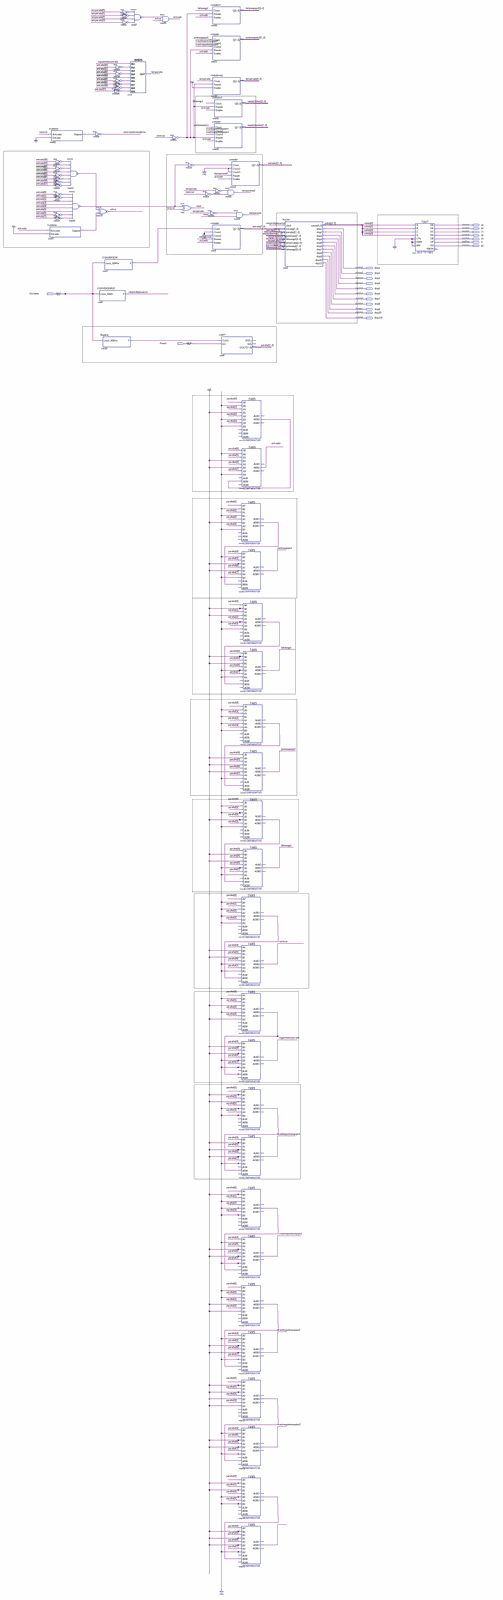
[diagram p0: schematic sheet, whole]
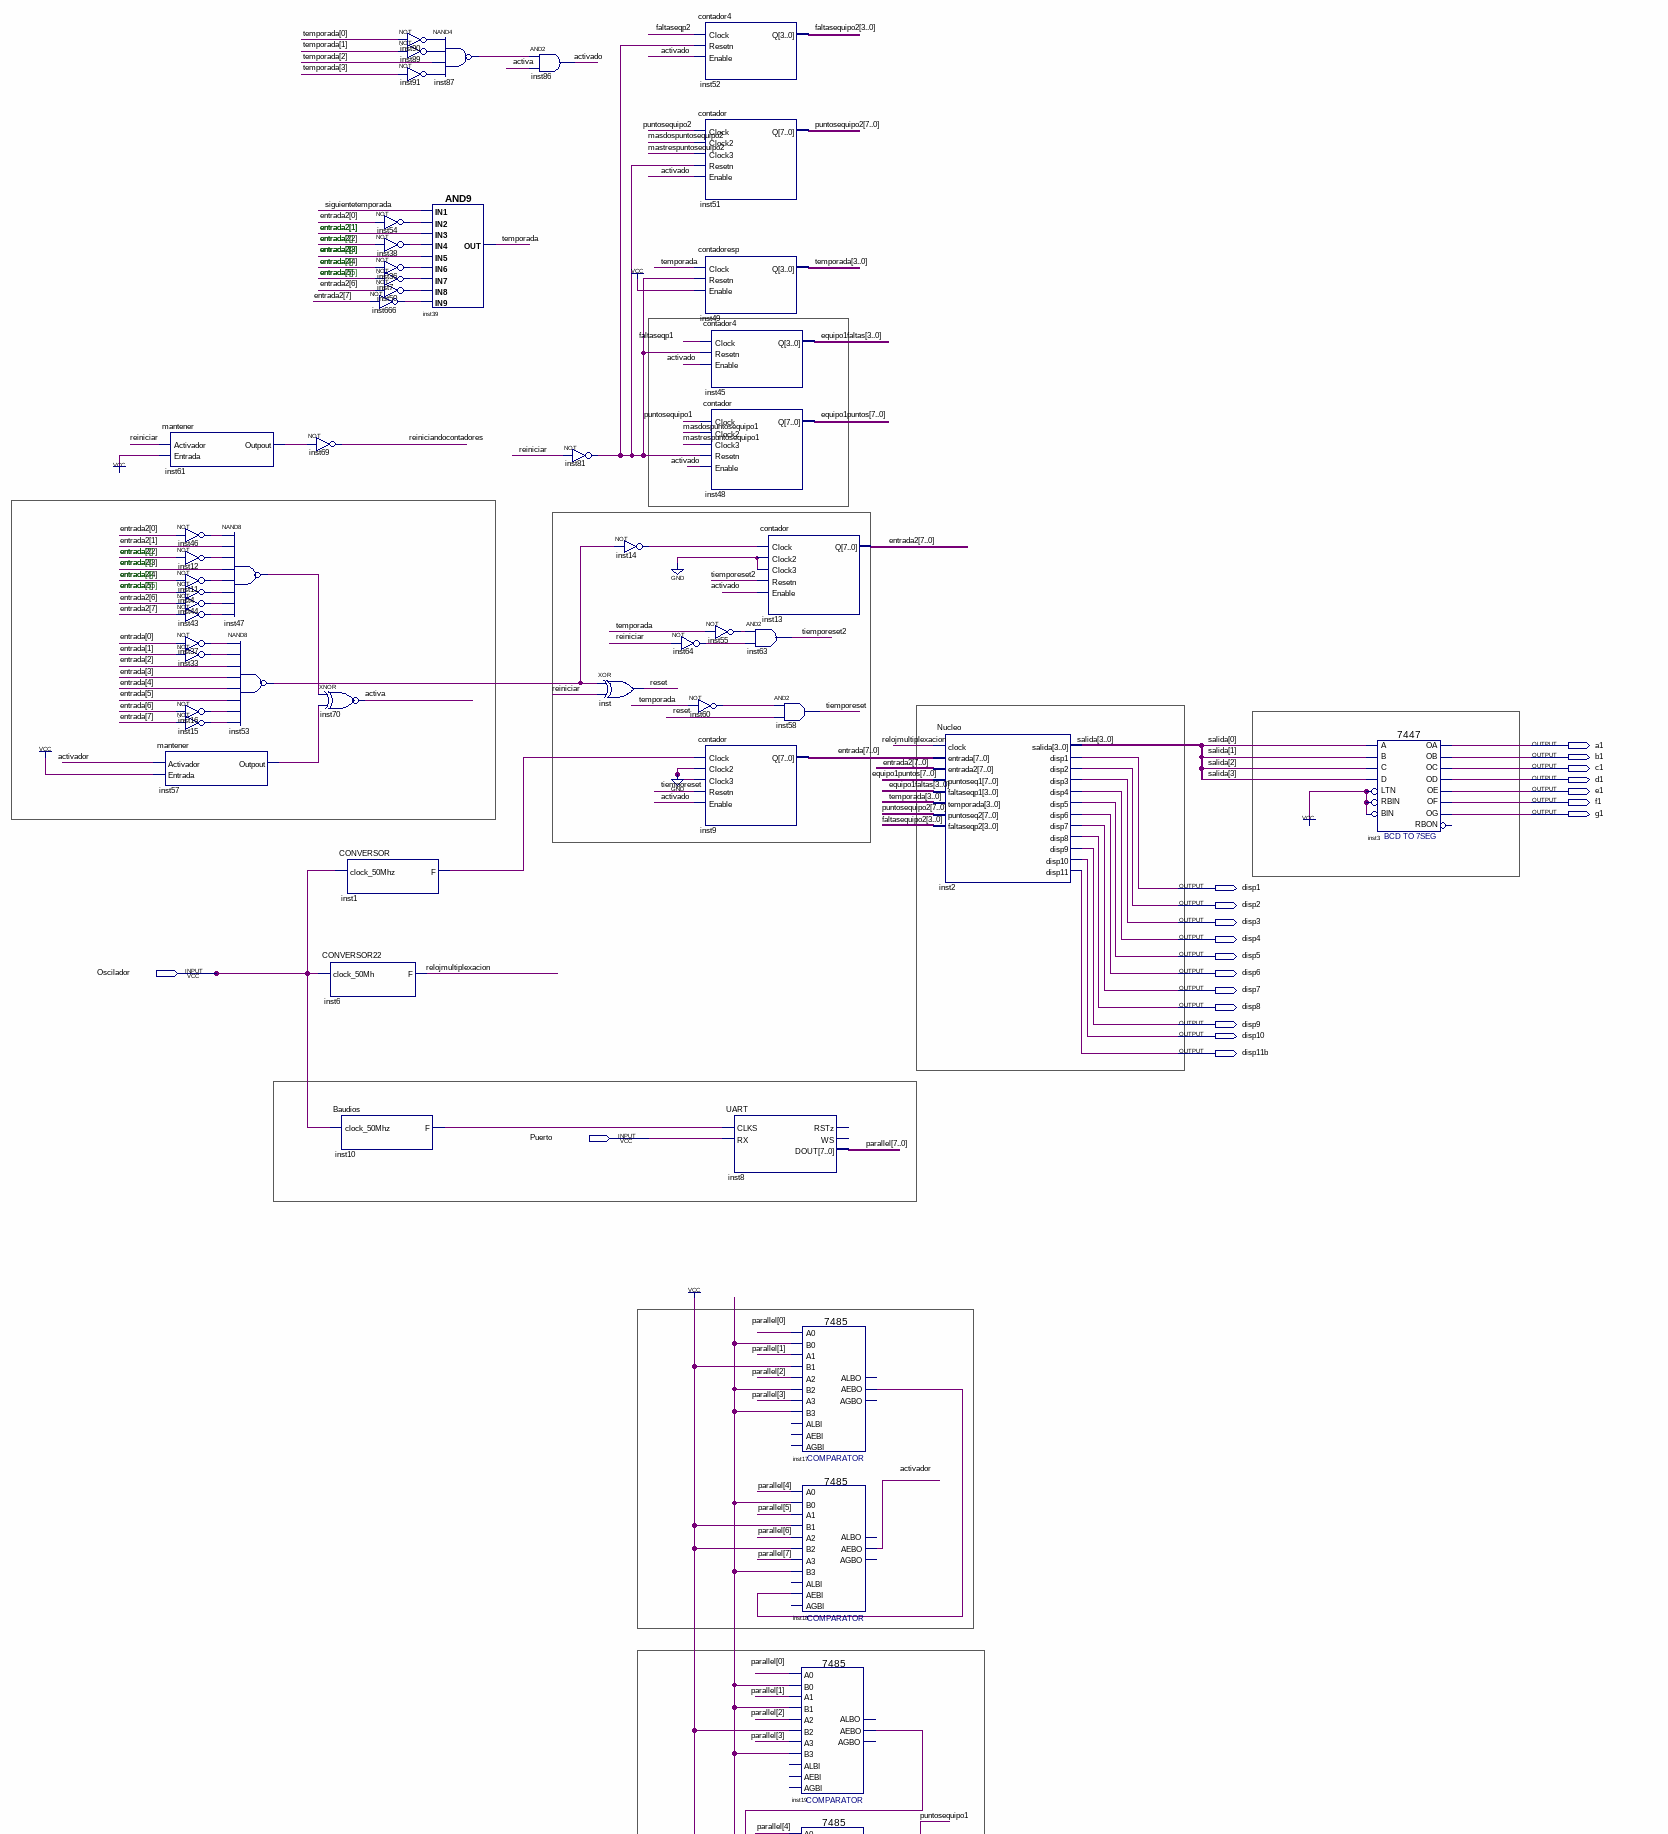
[diagram p1: schematic sheet, upper part]
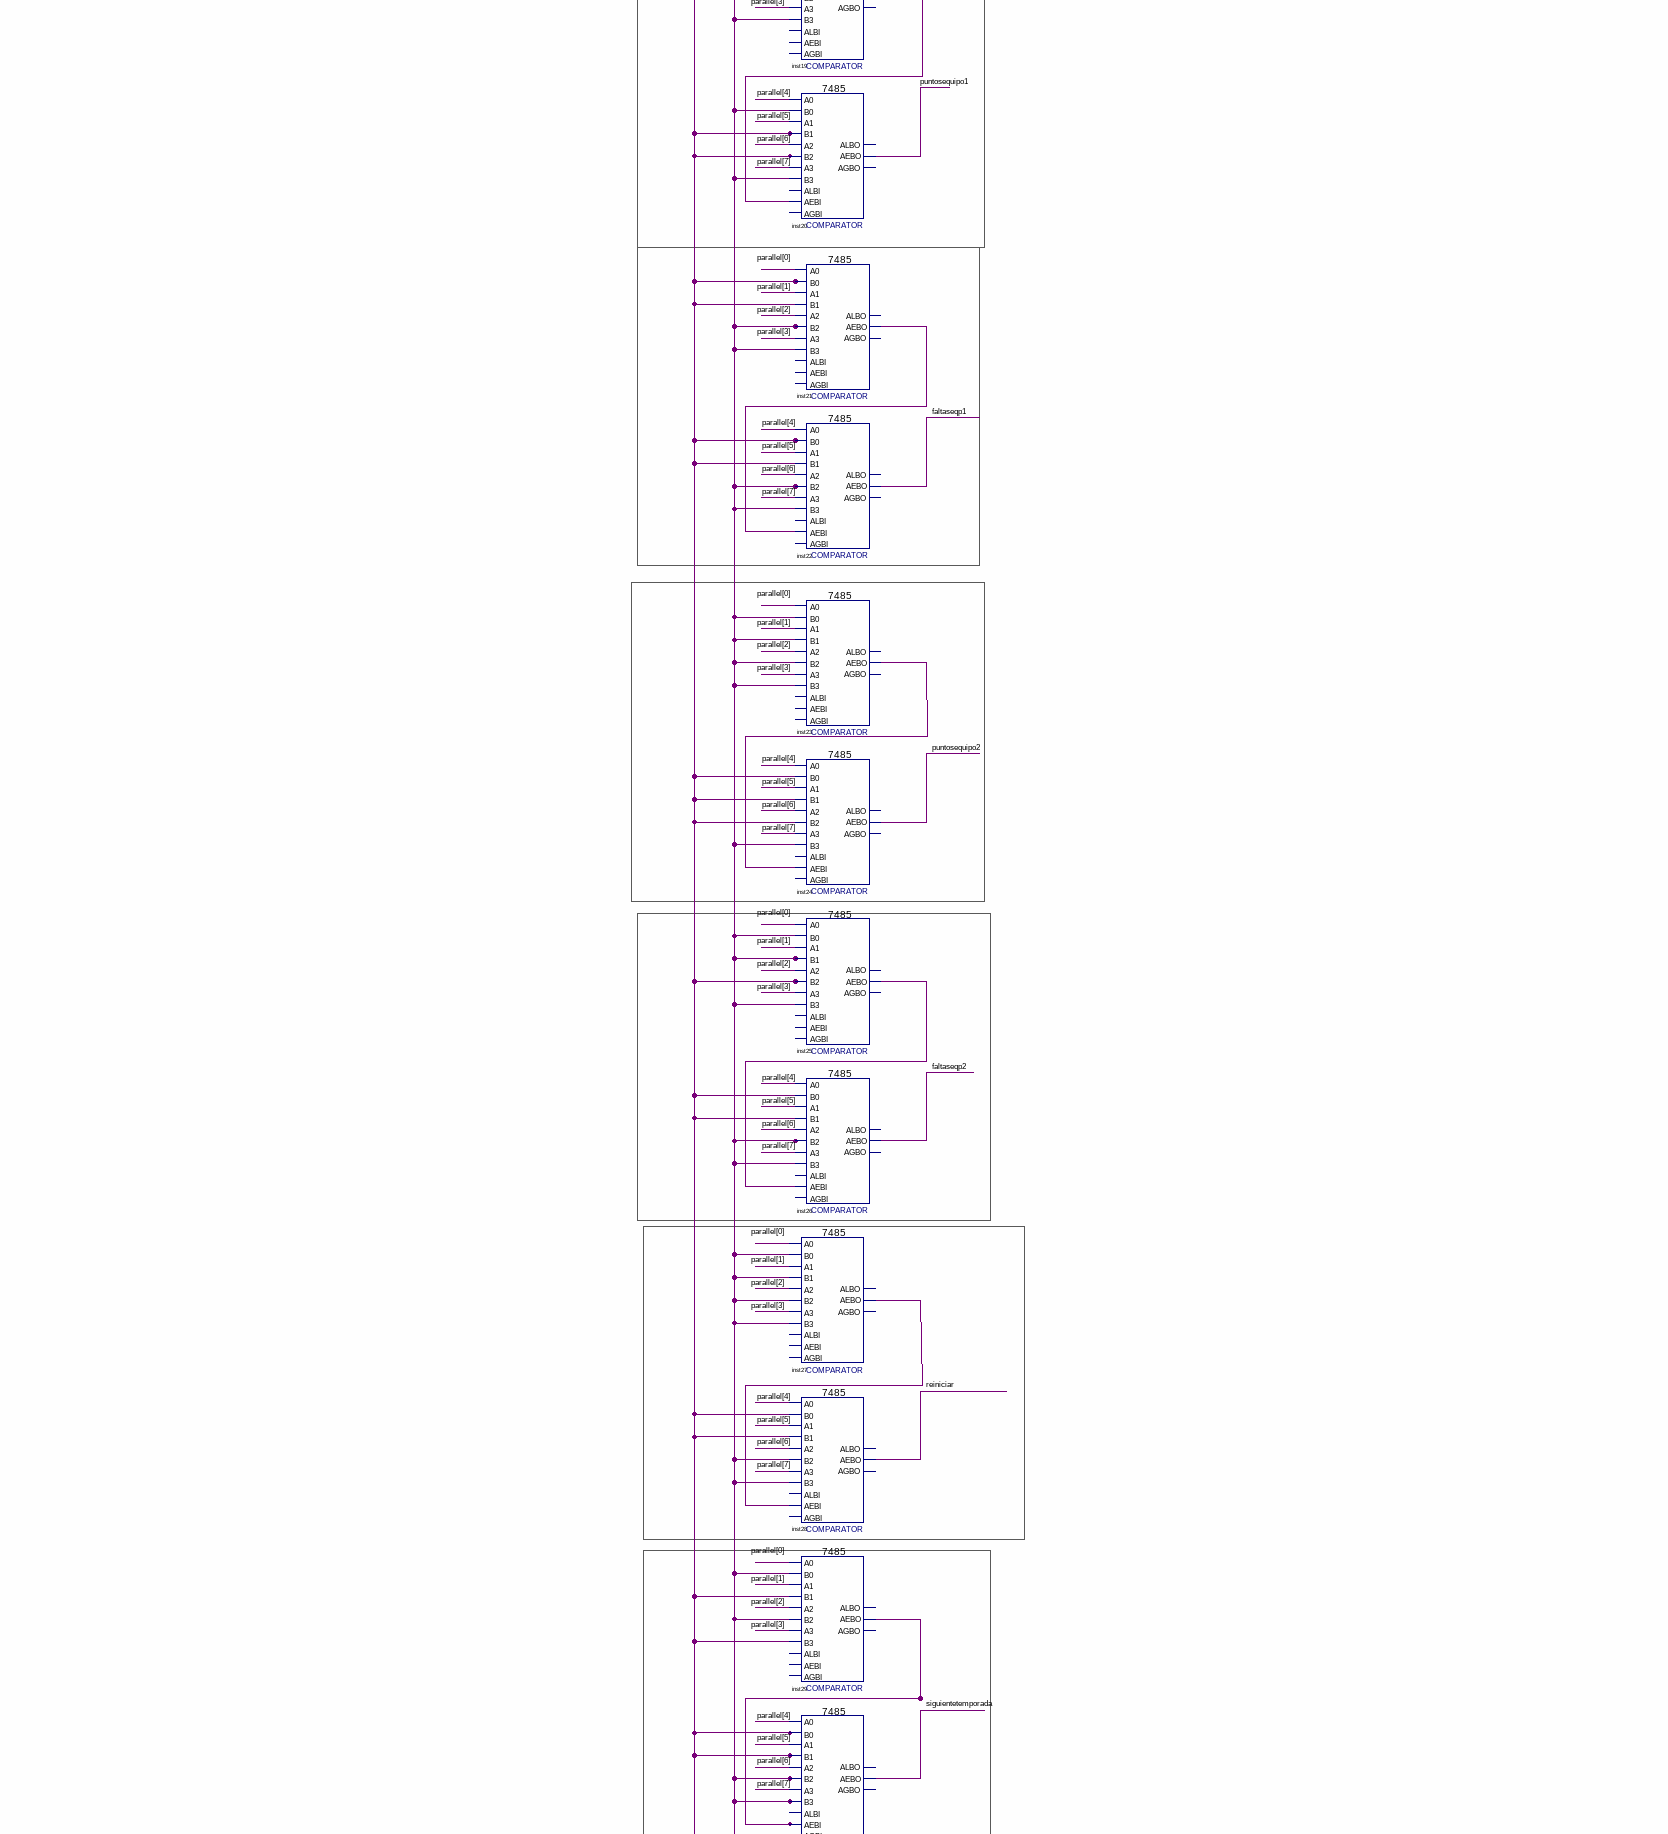
[diagram p2: schematic sheet, middle part]
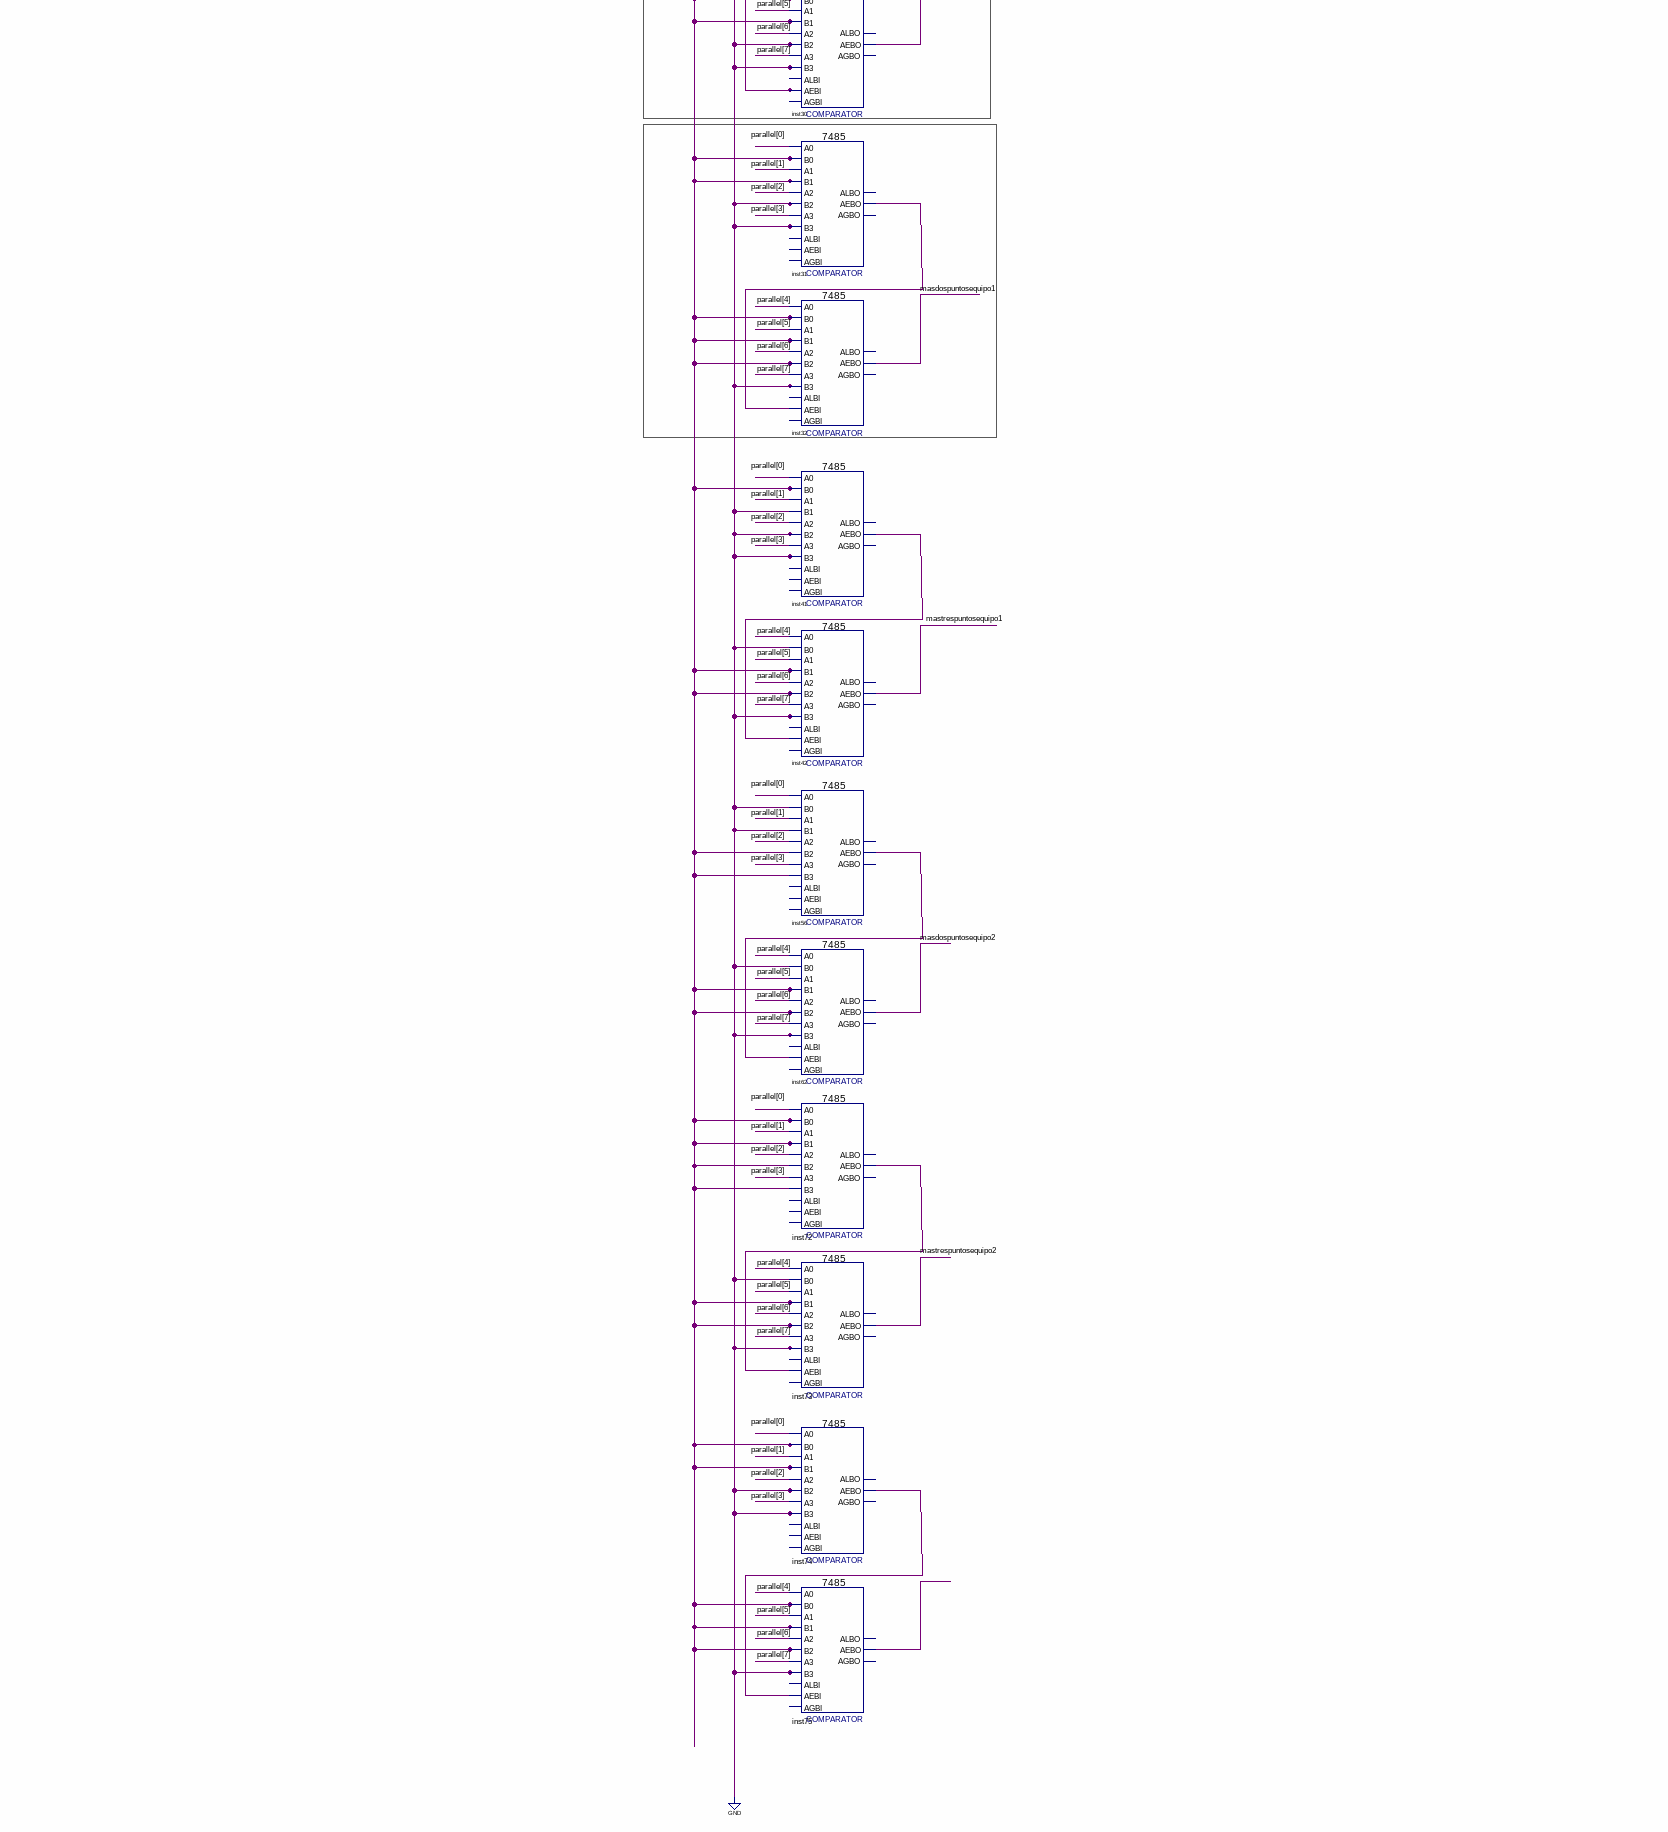
[diagram p3: schematic sheet, lower part]
// Quartus schematic SistemaEmbebidoBaloncesto.bdf as structural Verilog: 73 symbols, 20 pins
module SistemaEmbebidoBaloncesto (
  input  Oscilador,
  input  Puerto,
  output a1,
  output b1,
  output c1,
  output d1,
  output e1,
  output f1,
  output g1,
  output disp1,
  output disp2,
  output disp3,
  output disp4,
  output disp5,
  output disp6,
  output disp7,
  output disp8,
  output disp9,
  output disp10,
  output disp11b
);

  wire activa, activado, activador, faltaseqp1, faltaseqp2, inst1_f, inst4_out, inst7_out, inst10_f,
       inst11_out, inst12_out, inst14_out, inst15_out, inst16_out, inst17_aebo, inst19_aebo, inst21_aebo,
       inst23_aebo, inst25_aebo, inst27_aebo, inst29_aebo, inst31_aebo, inst33_out, inst36_out, inst37_out,
       inst38_out, inst41_aebo, inst43_out, inst44_out, inst46_out, inst47_out, inst50_out, inst53_out,
       inst54_out, inst55_out, inst56_aebo, inst57_outpout, inst60_out, inst61_outpout, inst64_out,
       inst72_aebo, inst74_aebo, inst75_aebo, inst81_out, inst87_out, inst89_out, inst90_out, inst91_out,
       inst666_out, masdospuntosequipo1, masdospuntosequipo2, mastrespuntosequipo1, mastrespuntosequipo2,
       puntosequipo1, puntosequipo2_1bit, reiniciandocontadores, reiniciar, relojmultiplexacion, reset,
       siguientetemporada, temporada_1bit, tiemporeset, tiemporeset2;
  wire [3:0] equipo1faltas, faltasequipo2, salida, temporada;
  wire [7:0] entrada, entrada2, equipo1puntos, parallel, puntosequipo2;

  mantener inst61 (.Activador(reiniciar), .Entrada(1'b1), .Outpout(inst61_outpout));
  mantener inst57 (.Activador(activador), .Entrada(1'b1), .Outpout(inst57_outpout));
  not inst46 (inst46_out, entrada2[0]);
  not inst12 (inst12_out, entrada2[2]);
  not inst11 (inst11_out, entrada2[4]);
  not inst4 (inst4_out, entrada[5]);
  not inst44 (inst44_out, entrada2[6]);
  not inst43 (inst43_out, entrada2[7]);
  not inst37 (inst37_out, entrada[0]);
  not inst33 (inst33_out, entrada[1]);
  not inst16 (inst16_out, entrada[6]);
  not inst15 (inst15_out, entrada[7]);
  nand inst47 (inst47_out, inst46_out, entrada2[1], inst12_out, entrada2[3], inst11_out, inst4_out, inst44_out, inst43_out);
  nand inst53 (inst53_out, inst37_out, inst33_out, entrada[2], entrada[3], entrada[4], entrada[5], inst16_out, inst15_out);
  not inst69 (reiniciandocontadores, inst61_outpout);
  xnor inst70 (activa, inst47_out, inst57_outpout);
  CONVERSOR inst1 (.clock_50Mhz(Oscilador), .F(inst1_f));
  CONVERSOR22 inst6 (.clock_50Mh(Oscilador), .F(relojmultiplexacion));
  Baudios inst10 (.clock_50Mhz(Oscilador), .F(inst10_f));
  not inst90 (inst90_out, temporada[0]);
  not inst89 (inst89_out, temporada[1]);
  not inst91 (inst91_out, temporada[3]);
  not inst54 (inst54_out, entrada2[0]);
  not inst38 (inst38_out, entrada2[2]);
  not inst36 (inst36_out, entrada2[4]);
  not inst7 (inst7_out, entrada[5]);
  not inst50 (inst50_out, entrada2[6]);
  not inst666 (inst666_out, entrada2[7]);
  nand inst87 (inst87_out, inst90_out, inst89_out, temporada[2], inst91_out);
  and inst39 (temporada_1bit, siguientetemporada, inst54_out, entrada2[1], inst38_out, entrada2[3], inst36_out, inst7_out, inst50_out, inst666_out);
  and inst86 (activado, inst87_out, activa);
  not inst81 (inst81_out, reiniciar);
  not inst14 (inst14_out, inst53_out);
  xor inst (reset, inst53_out, reiniciar);
  not inst64 (inst64_out, reiniciar);
  contador4 inst52 (.Clock(faltaseqp2), .Resetn(inst81_out), .Enable(activado), .Q(faltasequipo2));
  contador inst51 (
    .Clock(puntosequipo2_1bit), .Clock2(masdospuntosequipo2), .Clock3(mastrespuntosequipo2),
    .Resetn(inst81_out), .Enable(activado), .Q(puntosequipo2));
  contadoresp inst49 (.Clock(temporada_1bit), .Resetn(inst81_out), .Enable(1'b1), .Q(temporada));
  contador4 inst45 (.Clock(faltaseqp1), .Resetn(inst81_out), .Enable(activado), .Q(equipo1faltas));
  contador inst48 (
    .Clock(puntosequipo1), .Clock2(masdospuntosequipo1), .Clock3(mastrespuntosequipo1), .Resetn(inst81_out),
    .Enable(activado), .Q(equipo1puntos));
  not inst55 (inst55_out, temporada_1bit);
  not inst60 (inst60_out, temporada_1bit);
  contador inst9 (.Clock(inst1_f), .Clock2(1'b0), .Clock3(1'b0), .Resetn(tiemporeset), .Enable(activado), .Q(entrada));
  contador inst13 (
    .Clock(inst14_out), .Clock2(1'b0), .Clock3(1'b0), .Resetn(tiemporeset2), .Enable(activado), .Q(entrada2));
  and inst63 (tiemporeset2, inst55_out, inst64_out);
  UART inst8 (.CLKS(inst10_f), .RX(Puerto), .DOUT(parallel));  // open: RSTz, WS
  and inst58 (tiemporeset, inst60_out, reset);
  \7485  inst17 (
    .A3(parallel[3]), .B2(1'b0), .A2(parallel[2]), .A0(parallel[0]), .B0(1'b0), .B3(1'b0), .A1(parallel[1]),
    .B1(1'b1), .AEBO(inst17_aebo));  // open: AEBI, AGBI, ALBI, ALBO, AGBO
  \7485  inst18 (
    .A3(parallel[7]), .B2(1'b1), .A2(parallel[6]), .AEBI(inst17_aebo), .A0(parallel[4]), .B0(1'b0),
    .B3(1'b0), .A1(parallel[5]), .B1(1'b1), .AEBO(activador));  // open: AGBI, ALBI, ALBO, AGBO
  \7485  inst19 (
    .A3(parallel[3]), .B2(1'b1), .A2(parallel[2]), .A0(parallel[0]), .B0(1'b0), .B3(1'b0), .A1(parallel[1]),
    .B1(1'b0), .AEBO(inst19_aebo));  // open: AEBI, AGBI, ALBI, ALBO, AGBO
  \7485  inst20 (
    .A3(parallel[7]), .B2(1'b1), .A2(parallel[6]), .AEBI(inst19_aebo), .A0(parallel[4]), .B0(1'b0),
    .B3(1'b0), .A1(parallel[5]), .B1(1'b1), .AEBO(puntosequipo1));  // open: AGBI, ALBI, ALBO, AGBO
  \7485  inst21 (
    .A3(parallel[3]), .B2(1'b0), .A2(parallel[2]), .A0(parallel[0]), .B0(1'b1), .B3(1'b0), .A1(parallel[1]),
    .B1(1'b1), .AEBO(inst21_aebo));  // open: AEBI, AGBI, ALBI, ALBO, AGBO
  \7485  inst22 (
    .A3(parallel[7]), .B2(1'b0), .A2(parallel[6]), .AEBI(inst21_aebo), .A0(parallel[4]), .B0(1'b1),
    .B3(1'b0), .A1(parallel[5]), .B1(1'b1), .AEBO(faltaseqp1));  // open: AGBI, ALBI, ALBO, AGBO
  \7485  inst23 (
    .A3(parallel[3]), .B2(1'b0), .A2(parallel[2]), .A0(parallel[0]), .B0(1'b0), .B3(1'b0), .A1(parallel[1]),
    .B1(1'b0), .AEBO(inst23_aebo));  // open: AEBI, AGBI, ALBI, ALBO, AGBO
  \7485  inst24 (
    .A3(parallel[7]), .B2(1'b1), .A2(parallel[6]), .AEBI(inst23_aebo), .A0(parallel[4]), .B0(1'b1),
    .B3(1'b0), .A1(parallel[5]), .B1(1'b1), .AEBO(puntosequipo2_1bit));  // open: AGBI, ALBI, ALBO, AGBO
  \7485  inst25 (
    .A3(parallel[3]), .B2(1'b1), .A2(parallel[2]), .A0(parallel[0]), .B0(1'b0), .B3(1'b0), .A1(parallel[1]),
    .B1(1'b0), .AEBO(inst25_aebo));  // open: AEBI, AGBI, ALBI, ALBO, AGBO
  \7485  inst26 (
    .A3(parallel[7]), .B2(1'b0), .A2(parallel[6]), .AEBI(inst25_aebo), .A0(parallel[4]), .B0(1'b1),
    .B3(1'b0), .A1(parallel[5]), .B1(1'b1), .AEBO(faltaseqp2));  // open: AGBI, ALBI, ALBO, AGBO
  \7485  inst27 (
    .A3(parallel[3]), .B2(1'b0), .A2(parallel[2]), .A0(parallel[0]), .B0(1'b0), .B3(1'b0), .A1(parallel[1]),
    .B1(1'b0), .AEBO(inst27_aebo));  // open: AEBI, AGBI, ALBI, ALBO, AGBO
  \7485  inst28 (
    .A3(parallel[7]), .B2(1'b0), .A2(parallel[6]), .AEBI(inst27_aebo), .A0(parallel[4]), .B0(1'b1),
    .B3(1'b0), .A1(parallel[5]), .B1(1'b1), .AEBO(reiniciar));  // open: AGBI, ALBI, ALBO, AGBO
  \7485  inst29 (
    .A3(parallel[3]), .B2(1'b0), .A2(parallel[2]), .A0(parallel[0]), .B0(1'b0), .B3(1'b1), .A1(parallel[1]),
    .B1(1'b1), .AEBO(inst29_aebo));  // open: AEBI, AGBI, ALBI, ALBO, AGBO
  \7485  inst30 (
    .A3(parallel[7]), .B2(1'b0), .A2(parallel[6]), .AEBI(inst29_aebo), .A0(parallel[4]), .B0(1'b1),
    .B3(1'b0), .A1(parallel[5]), .B1(1'b1), .AEBO(siguientetemporada));  // open: AGBI, ALBI, ALBO, AGBO
  \7485  inst31 (
    .A3(parallel[3]), .B2(1'b0), .A2(parallel[2]), .A0(parallel[0]), .B0(1'b1), .B3(1'b0), .A1(parallel[1]),
    .B1(1'b1), .AEBO(inst31_aebo));  // open: AEBI, AGBI, ALBI, ALBO, AGBO
  \7485  inst32 (
    .A3(parallel[7]), .B2(1'b1), .A2(parallel[6]), .AEBI(inst31_aebo), .A0(parallel[4]), .B0(1'b1),
    .B3(1'b0), .A1(parallel[5]), .B1(1'b1), .AEBO(masdospuntosequipo1));  // open: AGBI, ALBI, ALBO, AGBO
  \7485  inst41 (
    .A3(parallel[3]), .B2(1'b0), .A2(parallel[2]), .A0(parallel[0]), .B0(1'b1), .B3(1'b0), .A1(parallel[1]),
    .B1(1'b0), .AEBO(inst41_aebo));  // open: AEBI, AGBI, ALBI, ALBO, AGBO
  \7485  inst42 (
    .A3(parallel[7]), .B2(1'b1), .A2(parallel[6]), .AEBI(inst41_aebo), .A0(parallel[4]), .B0(1'b0),
    .B3(1'b0), .A1(parallel[5]), .B1(1'b1), .AEBO(mastrespuntosequipo1));  // open: AGBI, ALBI, ALBO, AGBO
  \7485  inst56 (
    .A3(parallel[3]), .B2(1'b1), .A2(parallel[2]), .A0(parallel[0]), .B0(1'b0), .B3(1'b1), .A1(parallel[1]),
    .B1(1'b0), .AEBO(inst56_aebo));  // open: AEBI, AGBI, ALBI, ALBO, AGBO
  \7485  inst62 (
    .A3(parallel[7]), .B2(1'b1), .A2(parallel[6]), .AEBI(inst56_aebo), .A0(parallel[4]), .B0(1'b0),
    .B3(1'b0), .A1(parallel[5]), .B1(1'b1), .AEBO(masdospuntosequipo2));  // open: AGBI, ALBI, ALBO, AGBO
  \7485  inst72 (
    .A3(parallel[3]), .B2(1'b1), .A2(parallel[2]), .A0(parallel[0]), .B0(1'b1), .B3(1'b1), .A1(parallel[1]),
    .B1(1'b1), .AEBO(inst72_aebo));  // open: AEBI, AGBI, ALBI, ALBO, AGBO
  \7485  inst73 (
    .A3(parallel[7]), .B2(1'b1), .A2(parallel[6]), .AEBI(inst72_aebo), .A0(parallel[4]), .B0(1'b0),
    .B3(1'b0), .A1(parallel[5]), .B1(1'b1), .AEBO(mastrespuntosequipo2));  // open: AGBI, ALBI, ALBO, AGBO
  \7485  inst74 (
    .A3(parallel[3]), .B2(1'b0), .A2(parallel[2]), .A0(parallel[0]), .B0(1'b1), .B3(1'b0), .A1(parallel[1]),
    .B1(1'b1), .AEBO(inst74_aebo));  // open: AEBI, AGBI, ALBI, ALBO, AGBO
  \7485  inst75 (
    .A3(parallel[7]), .B2(1'b1), .A2(parallel[6]), .AEBI(inst74_aebo), .A0(parallel[4]), .B0(1'b1),
    .B3(1'b0), .A1(parallel[5]), .B1(1'b1), .AEBO(inst75_aebo));  // open: AGBI, ALBI, ALBO, AGBO
  Nucleo inst2 (
    .clock(relojmultiplexacion), .entrada(entrada), .entrada2(entrada2), .puntoseq1(equipo1puntos),
    .faltaseqp1(equipo1faltas), .temporada(temporada), .puntoseq2(puntosequipo2), .faltaseqp2(faltasequipo2),
    .salida(salida), .disp1(disp1), .disp2(disp2), .disp3(disp3), .disp4(disp4), .disp5(disp5),
    .disp6(disp6), .disp7(disp7), .disp8(disp8), .disp9(disp9), .disp10(disp10), .disp11(disp11b));
  \7447  inst3 (
    .LTN(1'b1), .B(salida[1]), .C(salida[2]), .D(salida[3]), .RBIN(1'b1), .BIN(1'b1), .A(salida[0]), .OB(b1),
    .OC(c1), .OE(e1), .OD(d1), .OF(f1), .OG(g1), .OA(a1));  // open: RBON

  // Notes on the sheet:
  //   entrada2[1]
  //   entrada[2]
  //   entrada2[3]
  //   entrada[3]
  //   entrada[4]
  //   entrada2[5]
  //   entrada[2]
  //   entrada[3]
  //   entrada[4]
  //   entrada2[5]
endmodule
